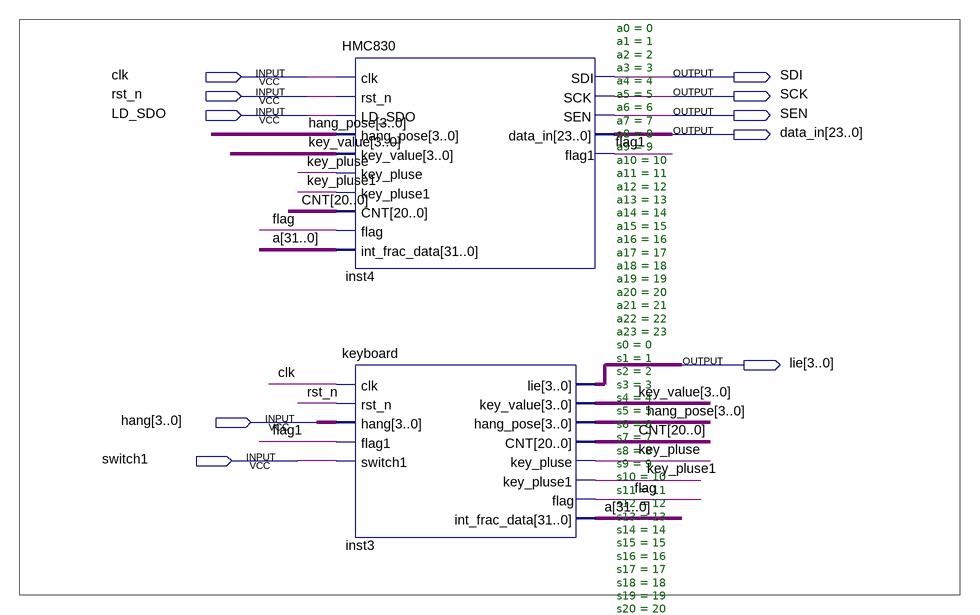
[diagram p0: schematic sheet]
// Quartus schematic top.bdf as structural Verilog: 2 symbols, 10 pins
module top (
  input  clk,
  input  rst_n,
  input  LD_SDO,
  input  [3:0] hang,
  input  switch1,
  output SDI,
  output SCK,
  output SEN,
  output [23:0] data_in,
  output [3:0] lie
);

  wire flag, flag1, key_pluse, key_pluse1;
  wire [3:0] hang_pose, key_value;
  wire [20:0] CNT;
  wire [31:0] a;

  HMC830 #(.a0(0), .a1(1), .a2(2), .a3(3), .a4(4), .a5(5), .a6(6), .a7(7), .a8(8), .a9(9), .a10(10), .a11(11), .a12(12), .a13(13), .a14(14), .a15(15), .a16(16), .a17(17), .a18(18), .a19(19), .a20(20), .a21(21), .a22(22), .a23(23), .s0(0), .s1(1), .s2(2), .s3(3), .s4(4), .s5(5), .s6(6), .s7(7), .s8(8), .s9(9), .s10(10), .s11(11), .s12(12), .s13(13), .s14(14), .s15(15), .s16(16), .s17(17), .s18(18), .s19(19), .s20(20), .s21(21), .s22(22), .s23(23), .s24(24), .s25(25), .s26(26), .s27(27), .s28(28), .s29(29), .s30(30), .s31(31), .s32(32), .s33(33), .s34(34), .s35(35), .s36(36), .s37(37), .s38(38), .s39(39), .s40(40), .s41(41), .s42(42), .s43(43), .s44(44), .s45(45), .s46(46), .s47(47), .s48(48), .s49(49), .s50(50), .s51(51), .s52(52), .s53(53), .s54(54), .s55(55), .s56(56), .s57(57), .s58(58), .s59(59), .s60(60), .s61(61), .s62(62), .s63(63), .s64(64), .s65(65), .s66(66), .s67(67), .s68(68), .s69(69), .s70(70), .r0(0), .r1(1), .r2(2), .r3(3), .r4(4), .r5(5), .r6(6), .r7(7), .r8(8), .r9(9), .r10(10), .r11(11), .r12(12), .r13(13), .r14(14), .r15(15), .r16(16), .r17(17), .r18(18), .r19(19), .r20(20), .r21(21), .r22(22), .r23(23), .r24(24), .r25(25), .r26(26), .r27(27), .r28(28), .r29(29), .r30(30), .r31(31), .r32(32), .r33(33), .r34(34), .r35(35), .r36(36), .r37(37), .r38(38), .r39(39), .r40(40), .r41(41), .r42(42), .r43(43), .r44(44), .r45(45), .r46(46), .r47(47), .r48(48), .r49(49), .r50(50), .r51(51), .r52(52), .r53(53), .r54(54), .r55(55), .r56(56), .r57(57), .r58(58), .r59(59), .r60(60), .r61(61), .r62(62), .r63(63), .r64(64), .r65(65), .r66(66), .r67(67), .r68(68), .r69(69)) inst4 (
    .clk(clk), .rst_n(rst_n), .LD_SDO(LD_SDO), .hang_pose(hang_pose), .key_value(key_value),
    .key_pluse(key_pluse), .key_pluse1(key_pluse1), .CNT(CNT), .flag(flag), .int_frac_data(a), .SDI(SDI),
    .SCK(SCK), .SEN(SEN), .data_in(data_in), .flag1(flag1));
  keyboard inst3 (
    .clk(clk), .rst_n(rst_n), .hang(hang), .flag1(flag1), .switch1(switch1), .lie(lie),
    .key_value(key_value), .hang_pose(hang_pose), .CNT(CNT), .key_pluse(key_pluse), .key_pluse1(key_pluse1),
    .flag(flag), .int_frac_data(a));
endmodule
